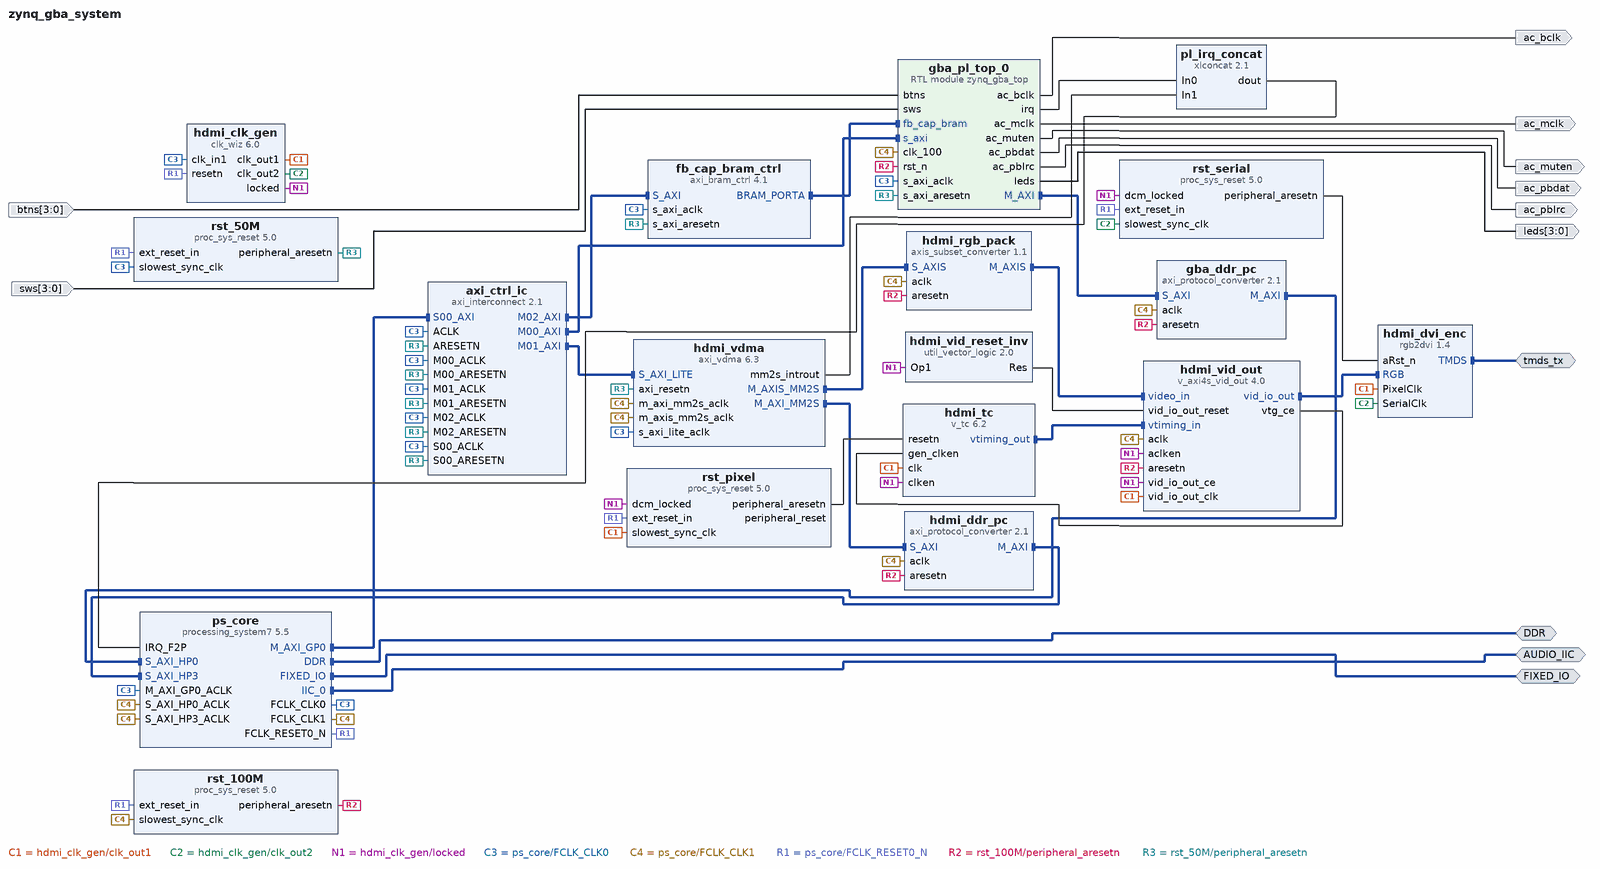
[diagram p0: block diagram of the top level]
# Vivado block design zynq_gba_system, xc7z020clg400-1, Vivado 2025.2.1
create_bd_design zynq_gba_system

create_bd_intf_port -mode Master -vlnv xilinx.com:interface:ddrx_rtl:1.0 DDR
create_bd_intf_port -mode Master -vlnv xilinx.com:display_processing_system7:fixedio_rtl:1.0 FIXED_IO
create_bd_intf_port -mode Master -vlnv digilentinc.com:interface:tmds_rtl:1.0 tmds_tx
create_bd_intf_port -mode Master -vlnv xilinx.com:interface:iic_rtl:1.0 AUDIO_IIC
create_bd_port -dir O ac_mclk
create_bd_port -dir O ac_bclk
create_bd_port -dir O ac_pblrc
create_bd_port -dir O ac_pbdat
create_bd_port -dir O ac_muten
create_bd_port -dir I -from 3 -to 0 btns
create_bd_port -dir I -from 3 -to 0 sws
create_bd_port -dir O -from 3 -to 0 leds

create_bd_cell -type ip -vlnv xilinx.com:ip:processing_system7:5.5 ps_core
set_property -dict [list \
  CONFIG.PCW_APU_PERIPHERAL_FREQMHZ 666.666667 \
  CONFIG.PCW_ENET0_ENET0_IO {MIO 16 .. 27} \
  CONFIG.PCW_ENET0_GRP_MDIO_ENABLE 1 \
  CONFIG.PCW_ENET0_GRP_MDIO_IO {MIO 52 .. 53} \
  CONFIG.PCW_ENET0_PERIPHERAL_ENABLE 1 \
  CONFIG.PCW_EN_CLK1_PORT 1 \
  CONFIG.PCW_FCLK_CLK1_BUF TRUE \
  CONFIG.PCW_FPGA0_PERIPHERAL_FREQMHZ 50 \
  CONFIG.PCW_FPGA1_PERIPHERAL_FREQMHZ 100 \
  CONFIG.PCW_FPGA_FCLK1_ENABLE 1 \
  CONFIG.PCW_I2C0_I2C0_IO EMIO \
  CONFIG.PCW_I2C0_PERIPHERAL_ENABLE 1 \
  CONFIG.PCW_I2C_PERIPHERAL_FREQMHZ 111.111115 \
  CONFIG.PCW_IRQ_F2P_INTR 1 \
  CONFIG.PCW_PRESET_BANK1_VOLTAGE {LVCMOS 1.8V} \
  CONFIG.PCW_QSPI_GRP_FBCLK_ENABLE 1 \
  CONFIG.PCW_QSPI_GRP_FBCLK_IO {MIO 8} \
  CONFIG.PCW_QSPI_GRP_SINGLE_SS_ENABLE 1 \
  CONFIG.PCW_QSPI_GRP_SINGLE_SS_IO {MIO 1 .. 6} \
  CONFIG.PCW_QSPI_PERIPHERAL_ENABLE 1 \
  CONFIG.PCW_QSPI_QSPI_IO {MIO 1 .. 6} \
  CONFIG.PCW_SD0_GRP_CD_ENABLE 1 \
  CONFIG.PCW_SD0_GRP_CD_IO {MIO 47} \
  CONFIG.PCW_SD0_GRP_WP_ENABLE 0 \
  CONFIG.PCW_SD0_PERIPHERAL_ENABLE 1 \
  CONFIG.PCW_SD0_SD0_IO {MIO 40 .. 45} \
  CONFIG.PCW_SDIO_PERIPHERAL_FREQMHZ 100 \
  CONFIG.PCW_SINGLE_QSPI_DATA_MODE x4 \
  CONFIG.PCW_TTC0_PERIPHERAL_ENABLE 1 \
  CONFIG.PCW_TTC0_TTC0_IO EMIO \
  CONFIG.PCW_TTC1_PERIPHERAL_ENABLE 1 \
  CONFIG.PCW_TTC1_TTC1_IO EMIO \
  CONFIG.PCW_UART1_PERIPHERAL_ENABLE 1 \
  CONFIG.PCW_UART1_UART1_IO {MIO 48 .. 49} \
  CONFIG.PCW_UART_PERIPHERAL_FREQMHZ 100 \
  CONFIG.PCW_UIPARAM_DDR_FREQ_MHZ 533.333333 \
  CONFIG.PCW_UIPARAM_DDR_PARTNO {MT41K256M16 RE-125} \
  CONFIG.PCW_USB0_PERIPHERAL_ENABLE 1 \
  CONFIG.PCW_USB0_USB0_IO {MIO 28 .. 39} \
  CONFIG.PCW_USE_FABRIC_INTERRUPT 1 \
  CONFIG.PCW_USE_S_AXI_HP0 1 \
  CONFIG.PCW_USE_S_AXI_HP3 1 \
] [get_bd_cells ps_core]
# 177 more settings of ps_core are not shown: defaults, MIO pin electricals, DDR timing, and values the tool derives
create_bd_cell -type ip -vlnv xilinx.com:ip:axi_interconnect:2.1 axi_ctrl_ic
set_property -dict {CONFIG.NUM_MI 3} [get_bd_cells axi_ctrl_ic]
create_bd_cell -type ip -vlnv xilinx.com:ip:axi_protocol_converter:2.1 gba_ddr_pc
set_property -dict {CONFIG.MI_PROTOCOL AXI3} [get_bd_cells gba_ddr_pc]
create_bd_cell -type ip -vlnv xilinx.com:ip:axi_protocol_converter:2.1 hdmi_ddr_pc
set_property -dict {CONFIG.MI_PROTOCOL AXI3} [get_bd_cells hdmi_ddr_pc]
create_bd_cell -type ip -vlnv xilinx.com:ip:proc_sys_reset:5.0 rst_50M
create_bd_cell -type ip -vlnv xilinx.com:ip:proc_sys_reset:5.0 rst_100M
create_bd_cell -type ip -vlnv xilinx.com:ip:proc_sys_reset:5.0 rst_pixel
create_bd_cell -type module -reference zynq_gba_top gba_pl_top_0
create_bd_cell -type ip -vlnv xilinx.com:ip:axi_vdma:6.3 hdmi_vdma
set_property -dict {CONFIG.c_include_s2mm 0} [get_bd_cells hdmi_vdma]
create_bd_cell -type ip -vlnv xilinx.com:ip:v_axi4s_vid_out:4.0 hdmi_vid_out
set_property -dict {CONFIG.C_HAS_ASYNC_CLK 1} [get_bd_cells hdmi_vid_out]
create_bd_cell -type ip -vlnv xilinx.com:ip:v_tc:6.2 hdmi_tc
set_property -dict {CONFIG.HAS_AXI4_LITE false CONFIG.VIDEO_MODE 480p CONFIG.enable_detection false} [get_bd_cells hdmi_tc]
create_bd_cell -type ip -vlnv xilinx.com:ip:clk_wiz:6.0 hdmi_clk_gen
set_property -dict [list \
  CONFIG.CLKOUT1_REQUESTED_OUT_FREQ 25.175 \
  CONFIG.CLKOUT2_REQUESTED_OUT_FREQ 125.875 \
  CONFIG.CLKOUT2_USED true \
  CONFIG.MMCM_CLKFBOUT_MULT_F 17.625 \
  CONFIG.MMCM_CLKIN1_PERIOD 20.000 \
  CONFIG.MMCM_CLKOUT0_DIVIDE_F 35.000 \
  CONFIG.MMCM_CLKOUT1_DIVIDE 7 \
  CONFIG.MMCM_DIVCLK_DIVIDE 1 \
  CONFIG.NUM_OUT_CLKS 2 \
  CONFIG.RESET_TYPE ACTIVE_LOW \
  CONFIG.USE_LOCKED true \
  CONFIG.USE_RESET true \
] [get_bd_cells hdmi_clk_gen]
create_bd_cell -type ip -vlnv digilentinc.com:ip:rgb2dvi:1.4 hdmi_dvi_enc
set_property -dict {CONFIG.kGenerateSerialClk false CONFIG.kRstActiveHigh false} [get_bd_cells hdmi_dvi_enc]
create_bd_cell -type ip -vlnv xilinx.com:ip:proc_sys_reset:5.0 rst_serial
create_bd_cell -type ip -vlnv xilinx.com:ip:xlconcat:2.1 pl_irq_concat
set_property -dict {CONFIG.NUM_PORTS 2} [get_bd_cells pl_irq_concat]
create_bd_cell -type ip -vlnv xilinx.com:ip:util_vector_logic:2.0 hdmi_vid_reset_inv
set_property -dict {CONFIG.C_OPERATION not CONFIG.C_SIZE 1} [get_bd_cells hdmi_vid_reset_inv]
create_bd_cell -type ip -vlnv xilinx.com:ip:axi_bram_ctrl:4.1 fb_cap_bram_ctrl
set_property -dict {CONFIG.DATA_WIDTH 32 CONFIG.SINGLE_PORT_BRAM 1} [get_bd_cells fb_cap_bram_ctrl]
create_bd_cell -type ip -vlnv xilinx.com:ip:axis_subset_converter:1.1 hdmi_rgb_pack
set_property -dict [list \
  CONFIG.M_HAS_TKEEP 1 \
  CONFIG.M_HAS_TLAST 1 \
  CONFIG.M_HAS_TREADY 1 \
  CONFIG.M_HAS_TSTRB 0 \
  CONFIG.M_TDATA_NUM_BYTES 3 \
  CONFIG.M_TDEST_WIDTH 0 \
  CONFIG.M_TID_WIDTH 0 \
  CONFIG.M_TUSER_WIDTH 1 \
  CONFIG.S_HAS_TKEEP 1 \
  CONFIG.S_HAS_TLAST 1 \
  CONFIG.S_HAS_TREADY 1 \
  CONFIG.S_HAS_TSTRB 0 \
  CONFIG.S_TDATA_NUM_BYTES 4 \
  CONFIG.S_TDEST_WIDTH 0 \
  CONFIG.S_TID_WIDTH 0 \
  CONFIG.S_TUSER_WIDTH 1 \
  CONFIG.TDATA_REMAP {tdata[23:16],tdata[7:0],tdata[15:8]} \
  CONFIG.TDEST_REMAP {1'b0} \
  CONFIG.TID_REMAP {1'b0} \
  CONFIG.TKEEP_REMAP {tkeep[2:0]} \
  CONFIG.TLAST_REMAP {tlast[0]} \
  CONFIG.TSTRB_REMAP {1'b0} \
  CONFIG.TUSER_REMAP {tuser[0:0]} \
] [get_bd_cells hdmi_rgb_pack]

# ---- connections ----

connect_bd_intf_net [get_bd_intf_pins axi_ctrl_ic/M00_AXI] [get_bd_intf_pins gba_pl_top_0/s_axi]
connect_bd_intf_net [get_bd_intf_pins axi_ctrl_ic/M01_AXI] [get_bd_intf_pins hdmi_vdma/S_AXI_LITE]
connect_bd_intf_net [get_bd_intf_pins axi_ctrl_ic/M02_AXI] [get_bd_intf_pins fb_cap_bram_ctrl/S_AXI]
connect_bd_intf_net [get_bd_intf_pins fb_cap_bram_ctrl/BRAM_PORTA] [get_bd_intf_pins gba_pl_top_0/fb_cap_bram]
connect_bd_intf_net [get_bd_intf_pins gba_ddr_pc/M_AXI] [get_bd_intf_pins ps_core/S_AXI_HP0]
connect_bd_intf_net [get_bd_intf_pins gba_pl_top_0/M_AXI] [get_bd_intf_pins gba_ddr_pc/S_AXI]
connect_bd_intf_net [get_bd_intf_pins hdmi_ddr_pc/M_AXI] [get_bd_intf_pins ps_core/S_AXI_HP3]
connect_bd_intf_net [get_bd_intf_pins hdmi_dvi_enc/TMDS] [get_bd_intf_ports tmds_tx]
connect_bd_intf_net [get_bd_intf_pins hdmi_rgb_pack/M_AXIS] [get_bd_intf_pins hdmi_vid_out/video_in]
connect_bd_intf_net [get_bd_intf_pins hdmi_tc/vtiming_out] [get_bd_intf_pins hdmi_vid_out/vtiming_in]
connect_bd_intf_net [get_bd_intf_pins hdmi_vdma/M_AXIS_MM2S] [get_bd_intf_pins hdmi_rgb_pack/S_AXIS]
connect_bd_intf_net [get_bd_intf_pins hdmi_vdma/M_AXI_MM2S] [get_bd_intf_pins hdmi_ddr_pc/S_AXI]
connect_bd_intf_net [get_bd_intf_pins hdmi_vid_out/vid_io_out] [get_bd_intf_pins hdmi_dvi_enc/RGB]
connect_bd_intf_net [get_bd_intf_pins ps_core/DDR] [get_bd_intf_ports DDR]
connect_bd_intf_net [get_bd_intf_pins ps_core/FIXED_IO] [get_bd_intf_ports FIXED_IO]
connect_bd_intf_net [get_bd_intf_pins ps_core/IIC_0] [get_bd_intf_ports AUDIO_IIC]
connect_bd_intf_net [get_bd_intf_pins ps_core/M_AXI_GP0] [get_bd_intf_pins axi_ctrl_ic/S00_AXI]
connect_bd_net [get_bd_ports btns] [get_bd_pins gba_pl_top_0/btns]
connect_bd_net [get_bd_pins gba_pl_top_0/ac_bclk] [get_bd_ports ac_bclk]
connect_bd_net [get_bd_pins gba_pl_top_0/ac_mclk] [get_bd_ports ac_mclk]
connect_bd_net [get_bd_pins gba_pl_top_0/ac_muten] [get_bd_ports ac_muten]
connect_bd_net [get_bd_pins gba_pl_top_0/ac_pbdat] [get_bd_ports ac_pbdat]
connect_bd_net [get_bd_pins gba_pl_top_0/ac_pblrc] [get_bd_ports ac_pblrc]
connect_bd_net [get_bd_pins gba_pl_top_0/irq] [get_bd_pins pl_irq_concat/In0]
connect_bd_net [get_bd_pins hdmi_clk_gen/clk_out1] \
  [get_bd_pins hdmi_vid_out/vid_io_out_clk] [get_bd_pins hdmi_dvi_enc/PixelClk] [get_bd_pins hdmi_tc/clk] \
  [get_bd_pins rst_pixel/slowest_sync_clk]
connect_bd_net [get_bd_pins hdmi_clk_gen/clk_out2] [get_bd_pins hdmi_dvi_enc/SerialClk] [get_bd_pins rst_serial/slowest_sync_clk]
connect_bd_net [get_bd_pins hdmi_clk_gen/locked] \
  [get_bd_pins rst_pixel/dcm_locked] [get_bd_pins hdmi_vid_out/aclken] [get_bd_pins hdmi_vid_out/vid_io_out_ce] \
  [get_bd_pins hdmi_tc/clken] [get_bd_pins hdmi_vid_reset_inv/Op1] [get_bd_pins rst_serial/dcm_locked]
connect_bd_net [get_bd_pins hdmi_vdma/mm2s_introut] [get_bd_pins pl_irq_concat/In1]
connect_bd_net [get_bd_pins hdmi_vid_out/vtg_ce] [get_bd_pins hdmi_tc/gen_clken]
connect_bd_net [get_bd_pins hdmi_vid_reset_inv/Res] [get_bd_pins hdmi_vid_out/vid_io_out_reset]
connect_bd_net -net leds_1 [get_bd_pins gba_pl_top_0/leds] [get_bd_ports leds]
connect_bd_net [get_bd_pins pl_irq_concat/dout] [get_bd_pins ps_core/IRQ_F2P]
connect_bd_net [get_bd_pins ps_core/FCLK_CLK0] \
  [get_bd_pins rst_50M/slowest_sync_clk] [get_bd_pins ps_core/M_AXI_GP0_ACLK] [get_bd_pins axi_ctrl_ic/ACLK] \
  [get_bd_pins axi_ctrl_ic/S00_ACLK] [get_bd_pins axi_ctrl_ic/M00_ACLK] [get_bd_pins axi_ctrl_ic/M01_ACLK] \
  [get_bd_pins gba_pl_top_0/s_axi_aclk] [get_bd_pins hdmi_vdma/s_axi_lite_aclk] [get_bd_pins axi_ctrl_ic/M02_ACLK] \
  [get_bd_pins fb_cap_bram_ctrl/s_axi_aclk] [get_bd_pins hdmi_clk_gen/clk_in1]
connect_bd_net [get_bd_pins ps_core/FCLK_CLK1] \
  [get_bd_pins rst_100M/slowest_sync_clk] [get_bd_pins ps_core/S_AXI_HP0_ACLK] [get_bd_pins ps_core/S_AXI_HP3_ACLK] \
  [get_bd_pins gba_ddr_pc/aclk] [get_bd_pins hdmi_ddr_pc/aclk] [get_bd_pins gba_pl_top_0/clk_100] \
  [get_bd_pins hdmi_vdma/m_axi_mm2s_aclk] [get_bd_pins hdmi_vdma/m_axis_mm2s_aclk] [get_bd_pins hdmi_vid_out/aclk] \
  [get_bd_pins hdmi_rgb_pack/aclk]
connect_bd_net [get_bd_pins ps_core/FCLK_RESET0_N] \
  [get_bd_pins rst_50M/ext_reset_in] [get_bd_pins rst_100M/ext_reset_in] [get_bd_pins rst_pixel/ext_reset_in] \
  [get_bd_pins hdmi_clk_gen/resetn] [get_bd_pins rst_serial/ext_reset_in]
connect_bd_net [get_bd_pins rst_100M/peripheral_aresetn] \
  [get_bd_pins gba_pl_top_0/rst_n] [get_bd_pins gba_ddr_pc/aresetn] [get_bd_pins hdmi_ddr_pc/aresetn] \
  [get_bd_pins hdmi_vid_out/aresetn] [get_bd_pins hdmi_rgb_pack/aresetn]
connect_bd_net [get_bd_pins rst_50M/peripheral_aresetn] \
  [get_bd_pins axi_ctrl_ic/ARESETN] [get_bd_pins axi_ctrl_ic/S00_ARESETN] [get_bd_pins axi_ctrl_ic/M00_ARESETN] \
  [get_bd_pins axi_ctrl_ic/M01_ARESETN] [get_bd_pins gba_pl_top_0/s_axi_aresetn] [get_bd_pins hdmi_vdma/axi_resetn] \
  [get_bd_pins axi_ctrl_ic/M02_ARESETN] [get_bd_pins fb_cap_bram_ctrl/s_axi_aresetn]
connect_bd_net [get_bd_pins rst_pixel/peripheral_aresetn] [get_bd_pins hdmi_tc/resetn]
# net rst_pixel_peripheral_reset has one end: rst_pixel/peripheral_reset
connect_bd_net [get_bd_pins rst_serial/peripheral_aresetn] [get_bd_pins hdmi_dvi_enc/aRst_n]
connect_bd_net [get_bd_ports sws] [get_bd_pins gba_pl_top_0/sws]

# ---- address map ----
assign_bd_address -offset 0x00000000 -range 1G -target_address_space [get_bd_addr_spaces gba_pl_top_0/M_AXI] [get_bd_addr_segs ps_core/S_AXI_HP0/HP0_DDR_LOWOCM]
assign_bd_address -offset 0x00000000 -range 1G -target_address_space [get_bd_addr_spaces hdmi_vdma/Data_MM2S] [get_bd_addr_segs ps_core/S_AXI_HP3/HP3_DDR_LOWOCM]
assign_bd_address -offset 0x40000000 -range 4K -target_address_space [get_bd_addr_spaces ps_core/Data] [get_bd_addr_segs gba_pl_top_0/s_axi/reg0]
assign_bd_address -offset 0x43000000 -range 64K -target_address_space [get_bd_addr_spaces ps_core/Data] [get_bd_addr_segs hdmi_vdma/S_AXI_LITE/Reg]
assign_bd_address -offset 0x44000000 -range 256K -target_address_space [get_bd_addr_spaces ps_core/Data] [get_bd_addr_segs fb_cap_bram_ctrl/S_AXI/Mem0]

validate_bd_design
save_bd_design
